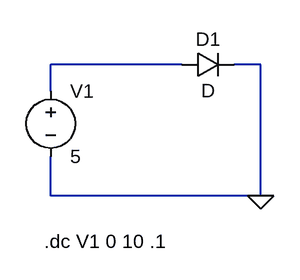
[diagram p0: schematic diode.asc]
diode.asc, the LTspice schematic file:
Version 4.1
SHEET 1 880 680
WIRE 192 112 32 112
WIRE 288 112 256 112
WIRE 32 144 32 112
WIRE 32 272 32 224
WIRE 288 272 288 112
WIRE 288 272 32 272
FLAG 288 272 0
SYMBOL voltage 32 128 R0
WINDOW 123 0 0 Left 0
WINDOW 39 0 0 Left 0
SYMATTR InstName V1
SYMATTR Value 5
SYMBOL diode 192 128 R270
WINDOW 0 32 32 VTop 2
WINDOW 3 0 32 VBottom 2
SYMATTR InstName D1
TEXT 24 328 Left 2 !.dc V1 0 10 .1

The netlist it stands for:
* diode.asc
V1 N001 0 5
D1 N001 0 D
.model D D
.lib standard.dio
.dc V1 0 10 .1
.backanno
.end